# Altium project Control Panel v2.PrjPcb
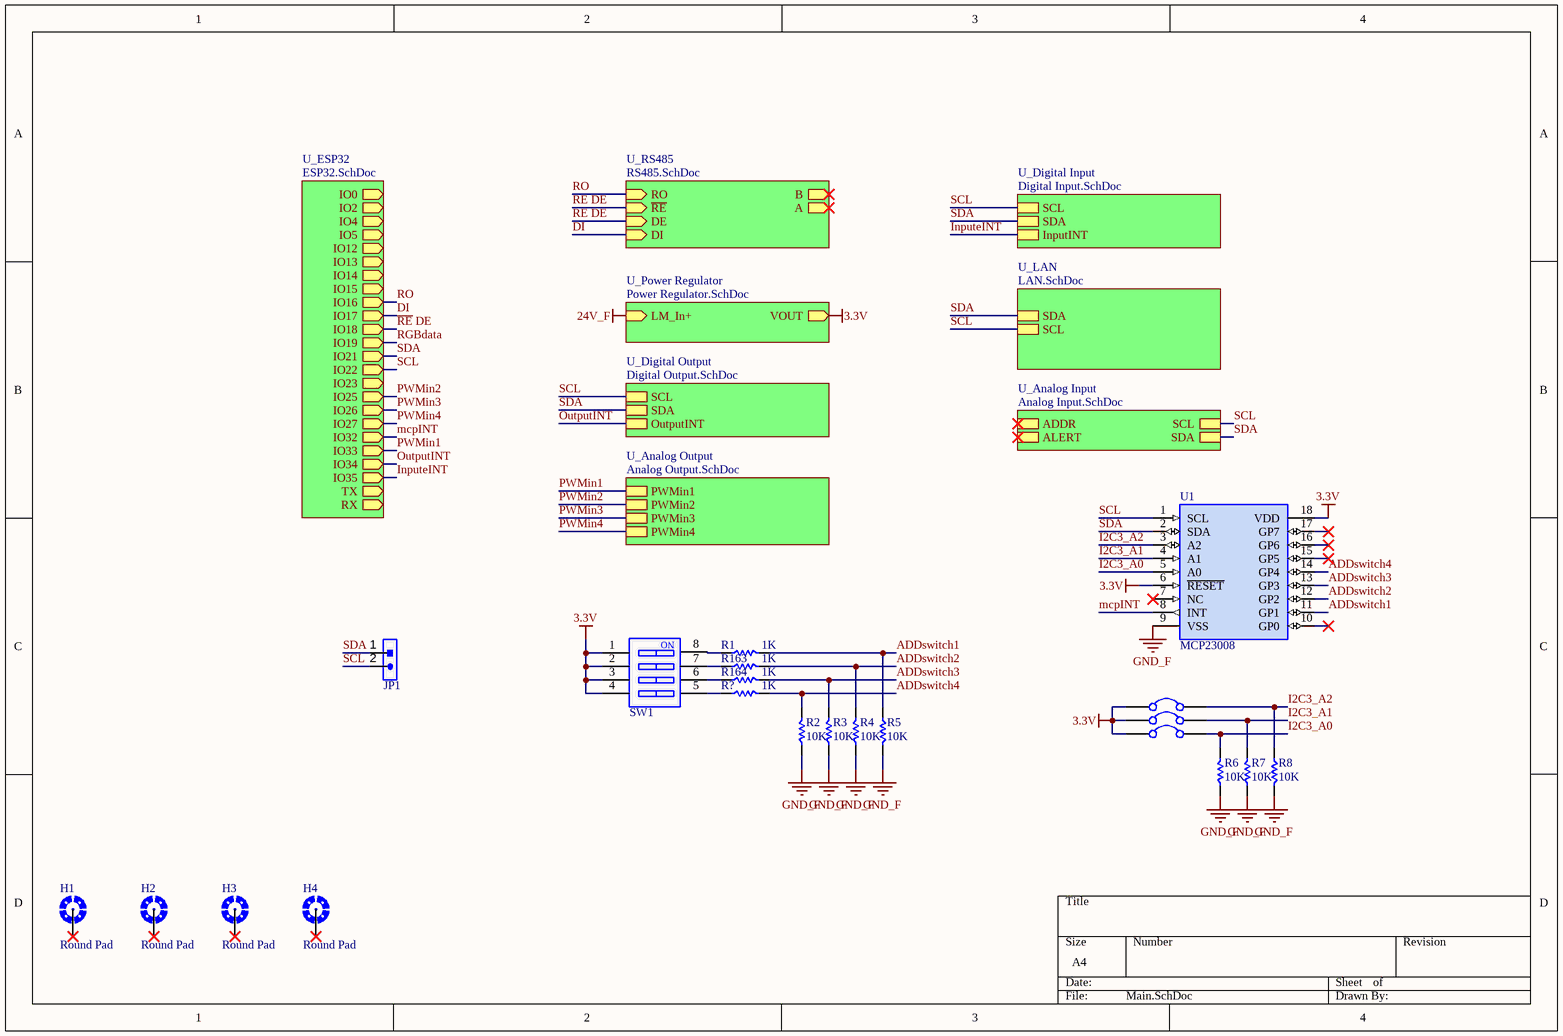
[diagram p0: Main.SchDoc]
8 sheets, 276 parts. Net scope: hierarchical (ports join the sheet entries above them; power ports are global).
Board file: Control Panel PCB v2.PcbDoc
Sheets:
  Main.SchDoc
    U_ESP32 = ESP32.SchDoc
    U_RS485 = RS485.SchDoc
    U_Power Regulator = Power Regulator.SchDoc
    U_Digital Output = Digital Output.SchDoc
    U_LAN = LAN.SchDoc
    U_Analog Input = Analog Input.SchDoc
    U_Analog Output = Analog Output.SchDoc

## Sheet Main.SchDoc
size A4; SheetNumber: 1; SheetTotal: 11

### Parts
(Parts that share a designator on the sheet are numbered #1, #2 ... from top to bottom, then left to right.)
H1  Round Pad  [P2.8CH]  (no BOM)
H2  Round Pad  [P2.8CH]  (no BOM)
H3  Round Pad  [P2.8CH]  (no BOM)
H4  Round Pad  [P2.8CH]  (no BOM)
JP1#1  HDR-1X2  [HDR-1X2_M]  (value not drawn)
R1  1K  [R 0805]
R2  10K  [R 0805]
R3  10K  [R 0805]
R4  10K  [R 0805]
R5  10K  [R 0805]
R6  10K  [R 0805]
R7  10K  [R 0805]
R8  10K  [R 0805]
R163  1K  [R 0805]
R164  1K  [R 0805]
R?  1K  [R 0805]
SB1  Solder Bridge  [Solder Bridge Open]  (value not drawn)
SB2  Solder Bridge  [Solder Bridge Open]  (value not drawn)
SB3  Solder Bridge  [Solder Bridge Open]  (value not drawn)
SW1  CSW-4P  [CSW DIP-4P_G]  (value not drawn)
U1  MCP23008  [SOP18W_M]

### Sub-sheets
U_Analog Input = Analog Input.SchDoc: ADDR, ALERT, SCL, SDA
U_Analog Output = Analog Output.SchDoc: PWMin1, PWMin2, PWMin3, PWMin4
U_Digital Input = Digital Input.SchDoc (file not in this document): SCL, SDA, InputINT
U_Digital Output = Digital Output.SchDoc: SCL, SDA, OutputINT
U_ESP32 = ESP32.SchDoc: IO2 (out), IO4 (out), IO5 (out), IO12 (out), IO13 (out), IO14 (out), IO15 (out), IO16 (out), IO17 (out), IO18 (out), IO19 (out), IO21 (out), IO22 (out), IO23 (out), IO25 (out), IO26 (out), IO27 (out), IO32 (out), IO33 (out), IO34 (out), IO35 (out), IO0 (out), TX (out), RX (out)
U_LAN = LAN.SchDoc: SDA, SCL
U_Power Regulator = Power Regulator.SchDoc: LM_In+ (in), VOUT (out)
U_RS485 = RS485.SchDoc: RO (in), ~{RE} (in), DE (in), DI (in), B (out), A (out)

### Nets
3.3V: SB1.1 SB2.1 SB3.1 SW1.1 SW1.2 SW1.3 SW1.4 U1.6(~{RESET}) U1.18(VDD) ; sheet U_Power Regulator/VOUT  [project net LM_Out+]
GND_F: R2.1 R3.1 R4.1 R5.2 R6.1 R7.1 R8.2 U1.9(VSS)
SHIELD: H1.P(Pad) H2.P(Pad) H3.P(Pad) H4.P(Pad)
ADDswitch1: R1.2 R5.1 U1.11(GP1)
ADDswitch2: R4.2 R163.2 U1.12(GP2)
ADDswitch3: R3.2 R164.2 U1.13(GP3)
ADDswitch4: R2.2 R?.2 U1.14(GP4)
DI: sheet U_ESP32/IO17, sheet U_RS485/DI  [project net 485_DI]
I2C3_A0: R6.2 SB3.2 U1.5(A0)
I2C3_A1: R7.2 SB2.2 U1.4(A1)
I2C3_A2: R8.1 SB1.2 U1.3(A2)
InputeINT: sheet U_ESP32/IO35, sheet U_Digital Input/InputINT
mcpINT: U1.8(INT) ; sheet U_ESP32/IO32
OutputINT: sheet U_ESP32/IO34, sheet U_Digital Output/OutputINT
PWMin1: sheet U_ESP32/IO33, sheet U_Analog Output/PWMin1
PWMin2: sheet U_ESP32/IO25, sheet U_Analog Output/PWMin2
PWMin3: sheet U_ESP32/IO26, sheet U_Analog Output/PWMin3
PWMin4: sheet U_ESP32/IO27, sheet U_Analog Output/PWMin4
~{RE} DE: sheet U_ESP32/IO18, sheet U_RS485/~{RE}, sheet U_RS485/DE  [project net 485_DE]
RO: sheet U_ESP32/IO16, sheet U_RS485/RO  [project net 485_RO]
SCL: JP1#1.2 U1.1(SCL) ; sheet U_ESP32/IO22, sheet U_Digital Output/SCL, sheet U_Digital Input/SCL, sheet U_LAN/SCL, sheet U_Analog Input/SCL
SDA: JP1#1.1 U1.2(SDA) ; sheet U_ESP32/IO21, sheet U_Digital Output/SDA, sheet U_Digital Input/SDA, sheet U_LAN/SDA, sheet U_Analog Input/SDA
NetR1_1: R1.1 SW1.8
NetR163_1: R163.1 SW1.7
NetR164_1: R164.1 SW1.6
NetR?_1: R?.1 SW1.5

Not connected (* = marked no-connect by the designer): U1 7(NC)* 10(GP0)* 15(GP5)* 16(GP6)* 17(GP7)*

### Notes on the sheet
- (in symbol CSW-4P) NO

### Library data of the parts
H1-H4 = MOUNT-PAD-ROUND-HOLES: MOUNTING PAD, round with holes around
JP1#1 = Header 2: 2P Connector; BOM名称: 2P接插件; 版权归属: 源创客; 学习资源: www.ooocke.com
R1-R8 R163 R164 R? = R: Chip resistor; 版权归属: 源创客; BOM名称: Chip resistor; 学习资源: www.ooocke.com
SW1 = CSW-4P: 4-way code switch; BOM名称: 4路编码开关; 版权归属: 源创客; 学习资源: www.ooocke.com
U1 = MCP23008: 8 Bit I/O Expander

## Sheet ESP32.SchDoc
size A4; SheetNumber: 6; SheetTotal: 11
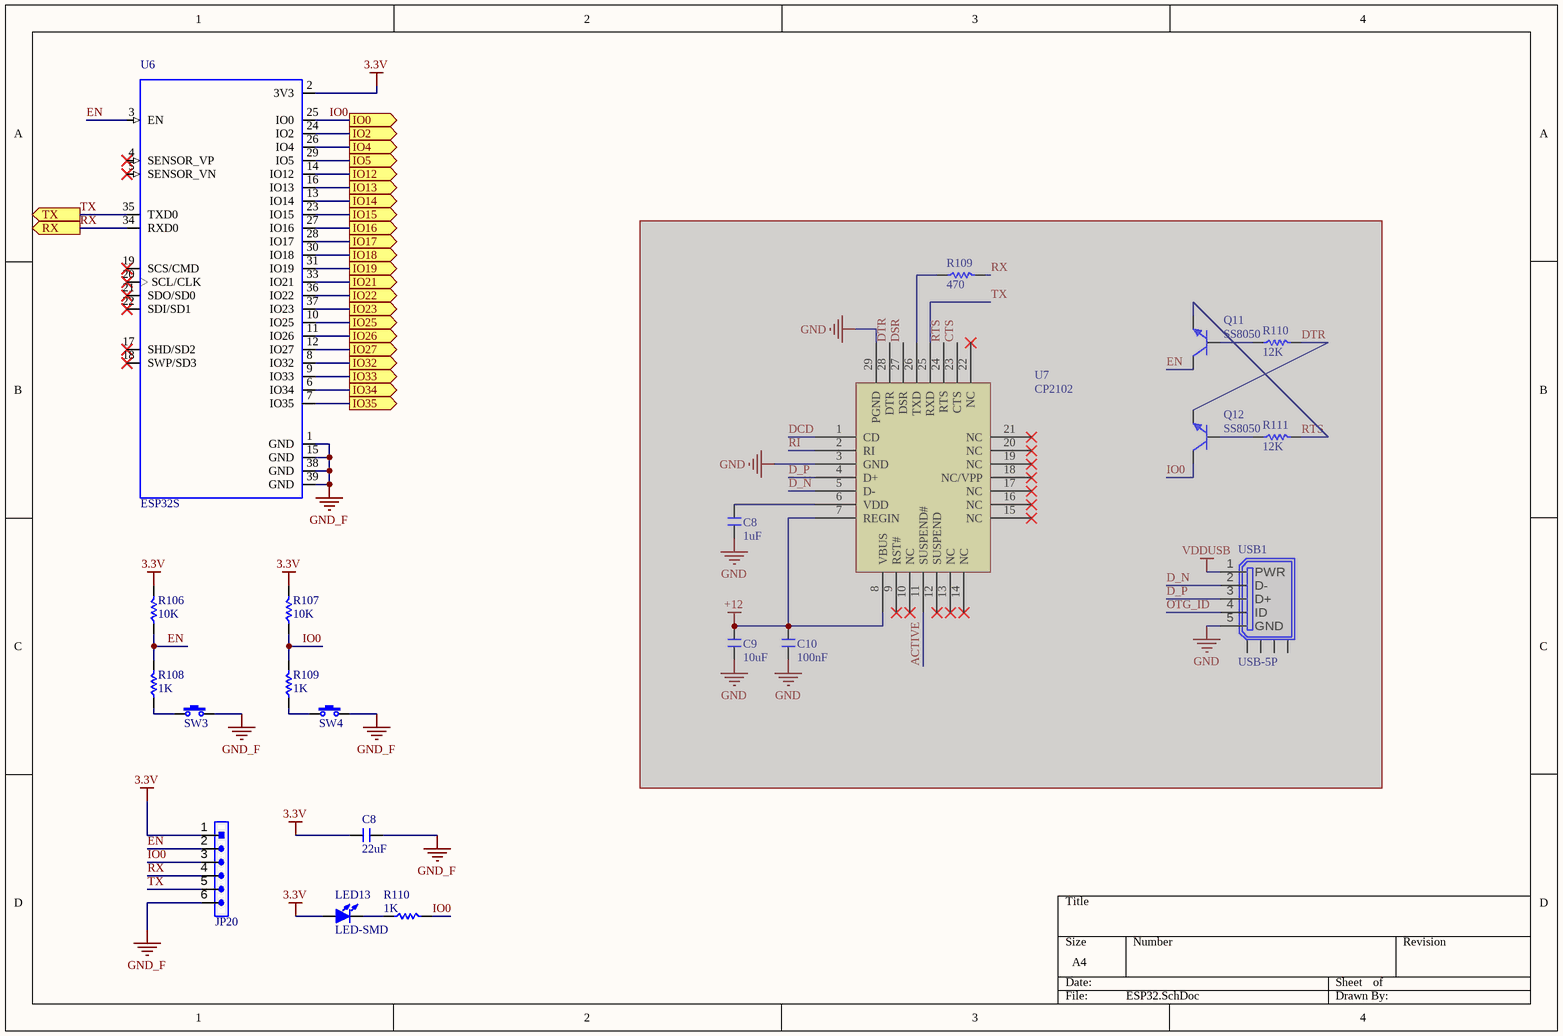
[diagram p1: ESP32.SchDoc]

### Parts
(Parts that share a designator on the sheet are numbered #1, #2 ... from top to bottom, then left to right.)
C8#1  1uF  [C 0805]  (masked out: inside a compile mask, not in the netlist)
C8#2  22uF  [C 0805]
C9#1  10uF  [C 0805]  (masked out: inside a compile mask, not in the netlist)
C10#1  100nF  [C 0805]  (masked out: inside a compile mask, not in the netlist)
JP20#1  HDR-1X6  [HDR-1X6]  (value not drawn)
LED13  LED-SMD  [LED 0805B]
Q11  SS8050  [SOT23-3N]  (masked out: inside a compile mask, not in the netlist)
Q12  SS8050  [SOT23-3N]  (masked out: inside a compile mask, not in the netlist)
R106  10K  [R 0805]
R107  10K  [R 0805]
R108  1K  [R 0805]
R109#1  470  [R 0805]  (masked out: inside a compile mask, not in the netlist)
R109#2  1K  [R 0805]
R110#1  12K  [R 0805]  (masked out: inside a compile mask, not in the netlist)
R110#2  1K  [R 0805]
R111#1  12K  [R 0805]  (masked out: inside a compile mask, not in the netlist)
SW3  3x6x5  [TSW SMD-3*6*2.5]  (value not drawn)
SW4  3x6x5  [TSW SMD-3*6*2.5]  (value not drawn)
U6  ESP32S  [ESP32S]
U7#1  CP2102  [QFN28]  (masked out: inside a compile mask, not in the netlist)
USB1  USB-5P  [USB-micro_B]  (masked out: inside a compile mask, not in the netlist)

### Ports
IO0 (out), IO2 (out), IO4 (out), IO5 (out), IO12 (out), IO13 (out), IO14 (out), IO15 (out), IO16 (out), IO17 (out), IO18 (out), IO19 (out), IO21 (out), IO22 (out), IO23 (out), IO25 (out), IO26 (out), IO27 (out), IO32 (out), IO33 (out), IO34 (out), IO35 (out), RX (out), TX (out)

### Nets
3.3V: C8#2.1 JP20#1.1 LED13.1(A) R106.2 R107.2 U6.2(3V3)  [project net LM_Out+]
GND_F: C8#2.2 JP20#1.6 SW3.2 SW4.2 U6.1(GND) U6.15(GND) U6.38(GND) U6.39(GND)
485_DE: U6.30(IO18) ; port IO18
485_DI: U6.28(IO17) ; port IO17
485_RO: U6.27(IO16) ; port IO16
EN: JP20#1.2 R106.1 R108.2 U6.3(EN)
InputeINT: U6.7(IO35) ; port IO35
IO0: JP20#1.3 R107.1 R109#2.2 R110#2.2 U6.25(IO0) ; port IO0
mcpINT: U6.8(IO32) ; port IO32
OutputINT: U6.6(IO34) ; port IO34
PWMin1: U6.9(IO33) ; port IO33
PWMin2: U6.10(IO25) ; port IO25
PWMin3: U6.11(IO26) ; port IO26
PWMin4: U6.12(IO27) ; port IO27
RGBdata: U6.31(IO19) ; port IO19
RX: JP20#1.4 U6.34(RXD0) ; port RX
SCL: U6.36(IO22) ; port IO22
SDA: U6.33(IO21) ; port IO21
TX: JP20#1.5 U6.35(TXD0) ; port TX
NetLED13_2: LED13.2(K) R110#2.1
NetR108_1: R108.1 SW3.1
NetR109#2_1: R109#2.1 SW4.1
NetU6_13: U6.13(IO14) ; port IO14
NetU6_14: U6.14(IO12) ; port IO12
NetU6_16: U6.16(IO13) ; port IO13
NetU6_23: U6.23(IO15) ; port IO15
NetU6_24: U6.24(IO2) ; port IO2
NetU6_26: U6.26(IO4) ; port IO4
NetU6_29: U6.29(IO5) ; port IO5
NetU6_37: U6.37(IO23) ; port IO23

Not connected (* = marked no-connect by the designer): U6 4(SENSOR_VP)* 5(SENSOR_VN)* 17(SHD/SD2)* 18(SWP/SD3)* 19(SCS/CMD)* 20(SCL/CLK)* 21(SDO/SD0)* 22(SDI/SD1)*

### Library data of the parts
C8#1 C8#2 C9#1 C10#1 = C: Non-polar patch capacitor; BOM名称: 无极性贴片电容; 版权归属: 源创客; 学习资源: www.ooocke.com
JP20#1 = Header 6: 6P Connector; BOM名称: 6P接插件; 版权归属: 源创客; 学习资源: www.ooocke.com
LED13 = LED-SMD: Patch LED; BOM名称: 贴片LED; 版权归属: 源创客; 学习资源: www.ooocke.com
Q11 Q12 = 8050-SMD: High frequency amplification-NPN; BOM名称: 高频放大-NPN型; 版权归属: 源创客; 属性: 40V 1.5A 1W 100MHZ; 学习资源: www.ooocke.com
R106-R108 R109#1 R109#2 R110#1 R110#2 R111#1 = R: Chip resistor; 版权归属: 源创客; BOM名称: Chip resistor; 学习资源: www.ooocke.com
SW3 SW4 = TSW 3x6: 3x6 tact switch; BOM名称: 3x6轻触开关; 版权归属: 源创客; 学习资源: www.ooocke.com
U6 = ESP32S: MP: ESP32-WROOM-32D; MF: Espressif Systems; Package: Module Espressif Systems; Price: None; Availability: Unavailable; SnapEDA_Link: https://www.snapeda.com/parts/ESP32-WROOM-32D/Espressif%20Systems/view-part/?ref=snap; Value: *
U7#1 = CP2102: USB to USRT converter
USB1 = USB-5P: Micro & Mini USB female; BOM名称: 微型USB母座; 版权归属: 源创客; 学习资源: www.ooocke.com

## Sheet RS485.SchDoc
size A4; SheetNumber: 5; SheetTotal: 11
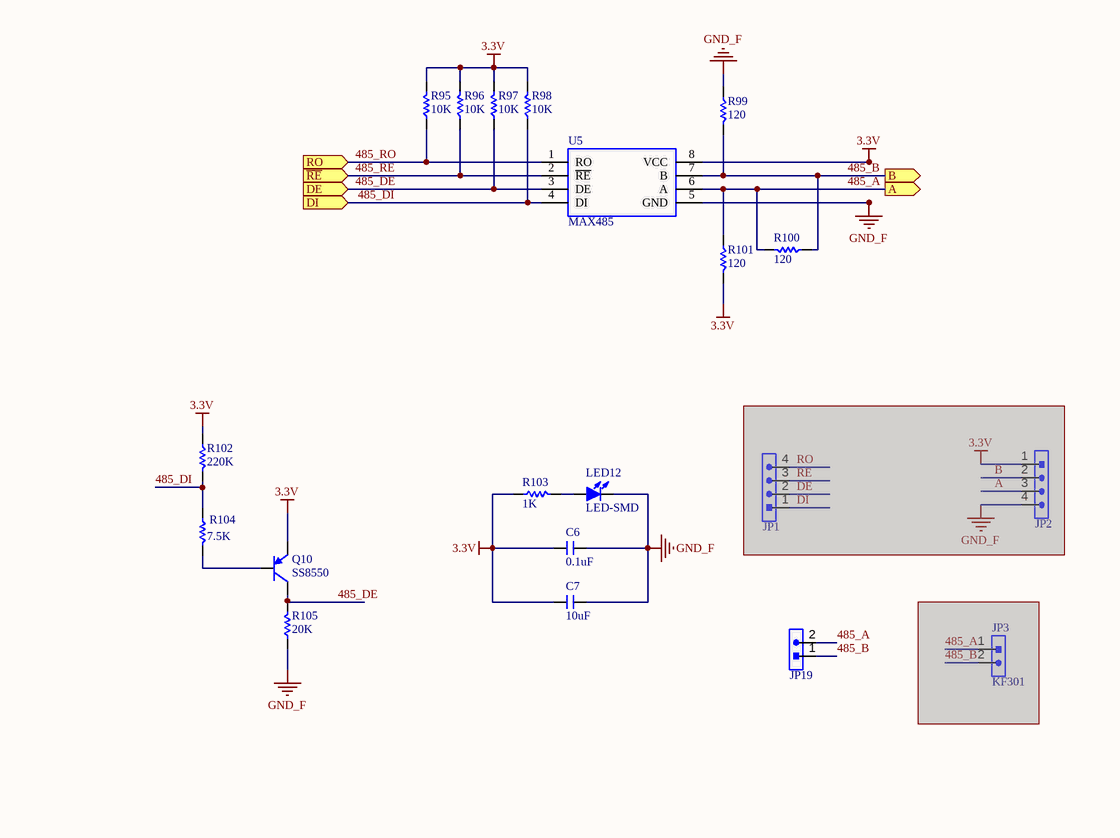
[diagram p2: RS485.SchDoc]

### Parts
(Parts that share a designator on the sheet are numbered #1, #2 ... from top to bottom, then left to right.)
C6  0.1uF  [C 0805]
C7  10uF  [C 1206]
JP1#2  HDR-1X4  [HDR-1X4]  (value not drawn)  (masked out: inside a compile mask, not in the netlist)
JP2#1  HDR-1X4  [HDR-1X4]  (value not drawn)  (masked out: inside a compile mask, not in the netlist)
JP3  KF301  [KF301-2P]  (masked out: inside a compile mask, not in the netlist)
JP19#1  HDR-1X2  [KF2EDGK-2P_H_5.08]  (value not drawn)
LED12  LED-SMD  [LED 0805R]
Q10  SS8550  [SOT23-3N]
R95  10K  [R 0805]
R96  10K  [R 0805]
R97  10K  [R 0805]
R98  10K  [R 0805]
R99  120  [R 0805]
R100  120  [R 0805]
R101  120  [R 0805]
R102  220K  [R 0805]
R103  1K  [R 0805]
R104  7.5K  [R 0805]
R105  20K  [R 0805]
U5  MAX485  [SOP8_N]

### Ports
A (out), B (out), DE (in), DI (in), RO (in), ~{RE} (in)

### Nets
3.3V: C6.1 C7.1 Q10.2(E) R95.2 R96.2 R97.2 R98.2 R101.2 R102.1 R103.1 U5.8(VCC)  [project net LM_Out+]
GND_F: C6.2 C7.2 LED12.2(K) R99.1 R105.1 U5.5(GND)
485_A: JP19#1.2 R100.2 R101.1 U5.6(A) ; port A
485_B: JP19#1.1 R99.2 R100.1 U5.7(B) ; port B
485_DE: Q10.3(C) R96.1 R97.1 R105.2 U5.2(~{RE}) U5.3(DE) ; port ~{RE}, port DE  [also labelled 485_~{RE}]
485_DI: R98.1 R102.2 R104.1 U5.4(DI) ; port DI
485_RO: R95.1 U5.1(RO) ; port RO
NetLED12_1: LED12.1(A) R103.2
NetQ10_1: Q10.1(B) R104.2

### Library data of the parts
C6 C7 = C: as C8#1 on sheet ESP32; 学习资源: www.ooocke.com
JP1#2 JP2#1 = Header 4: 4P Connector; BOM名称: 4P接插件; 版权归属: 源创客; 学习资源: www.ooocke.com
JP3 JP19#1 = Header 2: 2P Connector; BOM名称: 2P接插件; 版权归属: 源创客; 学习资源: www.ooocke.com
LED12 = LED-SMD: Patch LED; BOM名称: 贴片LED; 版权归属: 源创客; 学习资源: www.ooocke.com
Q10 = 8550-SMD: High Frequency Amplifier-PNP; BOM名称: 高频放大-PNP型; 版权归属: 源创客; 属性: 40V 1.5A 1W 100MHZ; 学习资源: www.ooocke.com
R95-R105 = R: Chip resistor; 版权归属: 源创客; BOM名称: Chip resistor; 学习资源: www.ooocke.com
U5 = MAX485: RS485/RS422 Transceivers; BOM名称: MAX232; 版权归属: 源创客; 学习资源: www.ooocke.com

## Sheet Power Regulator.SchDoc
size A4; SheetNumber: 2; SheetTotal: 11
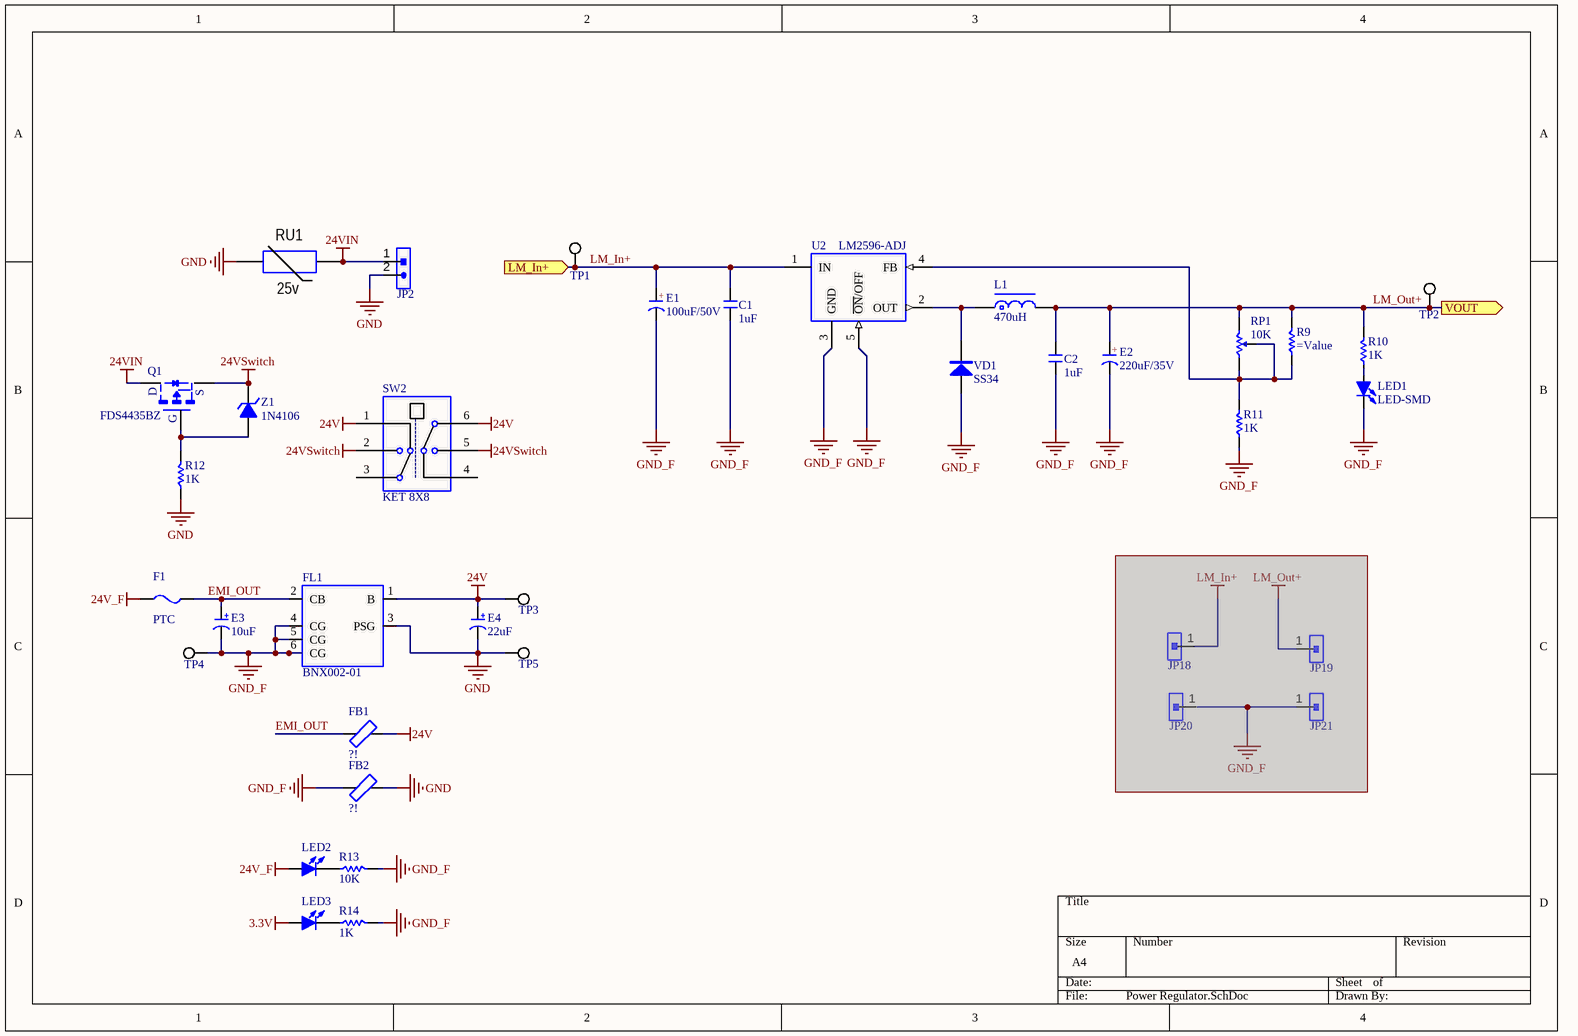
[diagram p3: Power Regulator.SchDoc]

### Parts
(Parts that share a designator on the sheet are numbered #1, #2 ... from top to bottom, then left to right.)
C1  1uF  [C 0805]
C2  1uF  [C 0805]
E1  100uF/50V  [CM E(8*10.2)]
E2  220uF/35V  [CM E(8*10.2)]
E3  10uF  [CM D(6.3*7.7)]
E4  22uF  [CM D(6.3*7.7)]
F1  PTC  [PTC]
FB1  ?!  [F 1206]
FB2  ?!  [F 1206]
FL1  BNX002-01  [FIL_BNX002-01]
JP2#2  HDR-1X2  [KF2EDGK-2P_H_7.62]  (value not drawn)
JP18#1  HDR-1X1  [HDR-1X1]  (value not drawn)  (masked out: inside a compile mask, not in the netlist)
JP19#2  HDR-1X1  [HDR-1X1]  (value not drawn)  (masked out: inside a compile mask, not in the netlist)
JP20#2  HDR-1X1  [HDR-1X1]  (value not drawn)  (masked out: inside a compile mask, not in the netlist)
JP21#1  HDR-1X1  [HDR-1X1]  (value not drawn)  (masked out: inside a compile mask, not in the netlist)
L1  470uH  [CDRH127]
LED1  LED-SMD  [LED 0805R]
LED2  LED-SMD  [LED 0805R]  (value not drawn)
LED3  LED-SMD  [LED 0805R]  (value not drawn)
Q1  FDS4435BZ  [SOP8-E3]
R9  (no value)  [R 0805]
R10  1K  [R 0805]
R11  1K  [R 0805]
R12  1K  [R 0805]
R13  10K  [R 0805]
R14  1K  [R 0805]
RP1  10K  [3296W]
RU1  25v  [SMA]
SW2  KET 8X8  [KFT DIP-8X8]
TP1  Test Point Pad  [TP15]  (value not drawn)
TP2  Test Point Pad  [TP15]  (value not drawn)
TP3  Test Point Pad  [TP15]  (value not drawn)
TP4  Test Point Pad  [TP15]  (value not drawn)
TP5  Test Point Pad  [TP15]  (value not drawn)
U2  LM2596-ADJ  [TO263-5A]
VD1  SS34  [SMA]
Z1  1N4106  [DO-213AA]

### Ports
LM_In+ (in), VOUT (out)

### Nets
24V: E4.1(A) FB1.2 FL1.1(B) SW2.1 SW2.6 TP3.1
24VIN: JP2#2.1 Q1.5-8(D) RU1.2
24VSwitch: Q1.1-3(S) SW2.2 SW2.5 Z1.2(K)
GND: E4.2(K) FB2.2 FL1.3(PSG) JP2#2.2 R12.1 RU1.1 TP5.1
GND_F: C1.1 C2.1 E1.2(K) E2.2(K) E3.2(K) FB2.1 FL1.4(CG) FL1.5(CG) FL1.6(CG) LED1.2(K) R11.1 R13.2 R14.2 TP4.1 U2.3(GND) U2.5(~{ON}/OFF) VD1.1(A)
LM_In+: C1.2 E1.1(A) F1.1 LED2.1(A) TP1.1 U2.1(IN) ; port LM_In+  [also labelled 24V_F]
LM_Out+: C2.2 E2.1(A) L1.2 LED3.1(A) R9.2 R10.2 RP1.2 TP2.1 ; port VOUT  [also labelled 3.3V]
EMI_OUT: E3.1(A) F1.2 FB1.1 FL1.2(CB)
NetL1_1: L1.1 U2.2(OUT) VD1.2(K)
NetLED1_1: LED1.1(A) R10.1
NetLED2_2: LED2.2(K) R13.1
NetLED3_2: LED3.2(K) R14.1
NetQ1_4: Q1.4(G) R12.2 Z1.1(A)
NetR9_1: R9.1 R11.2 RP1.1 RP1.ADJ U2.4(FB)

Not connected (* = marked no-connect by the designer): SW2 3 4

### Notes on the sheet
- (in symbol C-CM) +
- (in symbol KET 8X8) ---------------

### Library data of the parts
C1 C2 = C: as C8#1 on sheet ESP32; 学习资源: www.ooocke.com
E1-E4 = C-CM: Chip electrolytic capacitor; BOM名称: 贴片电解电容; 版权归属: 源创客; 学习资源: www.ooocke.com
FB1 FB2 = FB: Ferrite Bead; BOM名称: 贴片电阻; 版权归属: 源创客; 学习资源: www.ooocke.com
FL1 = BNX002-01: LC EMI Filter 5th Order Low Pass 2 Channel 10A Block, 4 Lead; MF: Murata; Package: Block-4 Murata; Price: None; SnapEDA_Link: https://www.snapeda.com/parts/BNX002-01/Murata%20Electronics%20North%20America/view-part/12269/?ref=snap; Availability: Unavailable; Value: *; MP: BNX002-01
JP2#2 = Header 2: 2P Connector; BOM名称: 2P接插件; 版权归属: 源创客; 学习资源: www.ooocke.com
JP18#1 JP19#2 JP20#2 JP21#1 = Header 1: 1P Connector; BOM名称: 1P接插件; 版权归属: 源创客; 学习资源: www.ooocke.com
L1 = L-CDRH: Power shielded inductor; BOM名称: 功率屏蔽电感; 版权归属: 源创客; 学习资源: www.ooocke.com
LED1-LED3 = LED-SMD: Patch LED; BOM名称: 贴片LED; 版权归属: 源创客; 学习资源: www.ooocke.com
R9-R14 = R: Chip resistor; 版权归属: 源创客; BOM名称: Chip resistor; 学习资源: www.ooocke.com
RP1 = RP-THD: Plug-in potentiometer; BOM名称: 插件电位器; 版权归属: 源创客; 学习资源: www.ooocke.com
RU1 = V: Versiror; Manufacturer: *; Model: *; HelpURL: *; ComponentKind: *; Value: *
SW2 = KET 8X8: 8*8 switch; BOM名称: 8*8开关; 版权归属: 源创客; 学习资源: www.ooocke.com
TP1-TP5 = Test Point Pad: Company: SJ Libraries; Designer: Eng. Saeid Jorablo; Rule: UNIONINDEX=0|RULEKIND=ComponentClearance|NETSCOPE=AnyNet|LAYERKIND=SameLayer|NAME=Schematic Component Clearance Constraint|GAP=0mil|COLLISIONCHECKMODE=3|VERTICALGAP=0mil|SHOWDISTANCES=FALSE|UNIT=Imperial; Mounting Technology: Surface Mount\Through-Hole; ComponentLink1Description: Datasheet; Pin Count: 0; Update Date: 6/3/2012; Category: MISC; HelpURL: http://s3.picofile.com/file/7443264187/Coming_Soon_logo.gif
U2 = LM2596: DC step-down chip; BOM名称: DC稳压芯片; 版权归属: 源创客; 学习资源: www.ooocke.com
VD1 = SS34: Schottky diodes; BOM名称: 肖特基二极管; 版权归属: 源创客; 属性: 40V/3A; 学习资源: www.ooocke.com
Z1 = 1N4106: 12V/0.5W voltage regulator; BOM名称: 12V/0.5W稳压管; 版权归属: 源创客; 学习资源: www.ooocke.com

## Sheet Digital Output.SchDoc
size A4; SheetNumber: 4; SheetTotal: 11
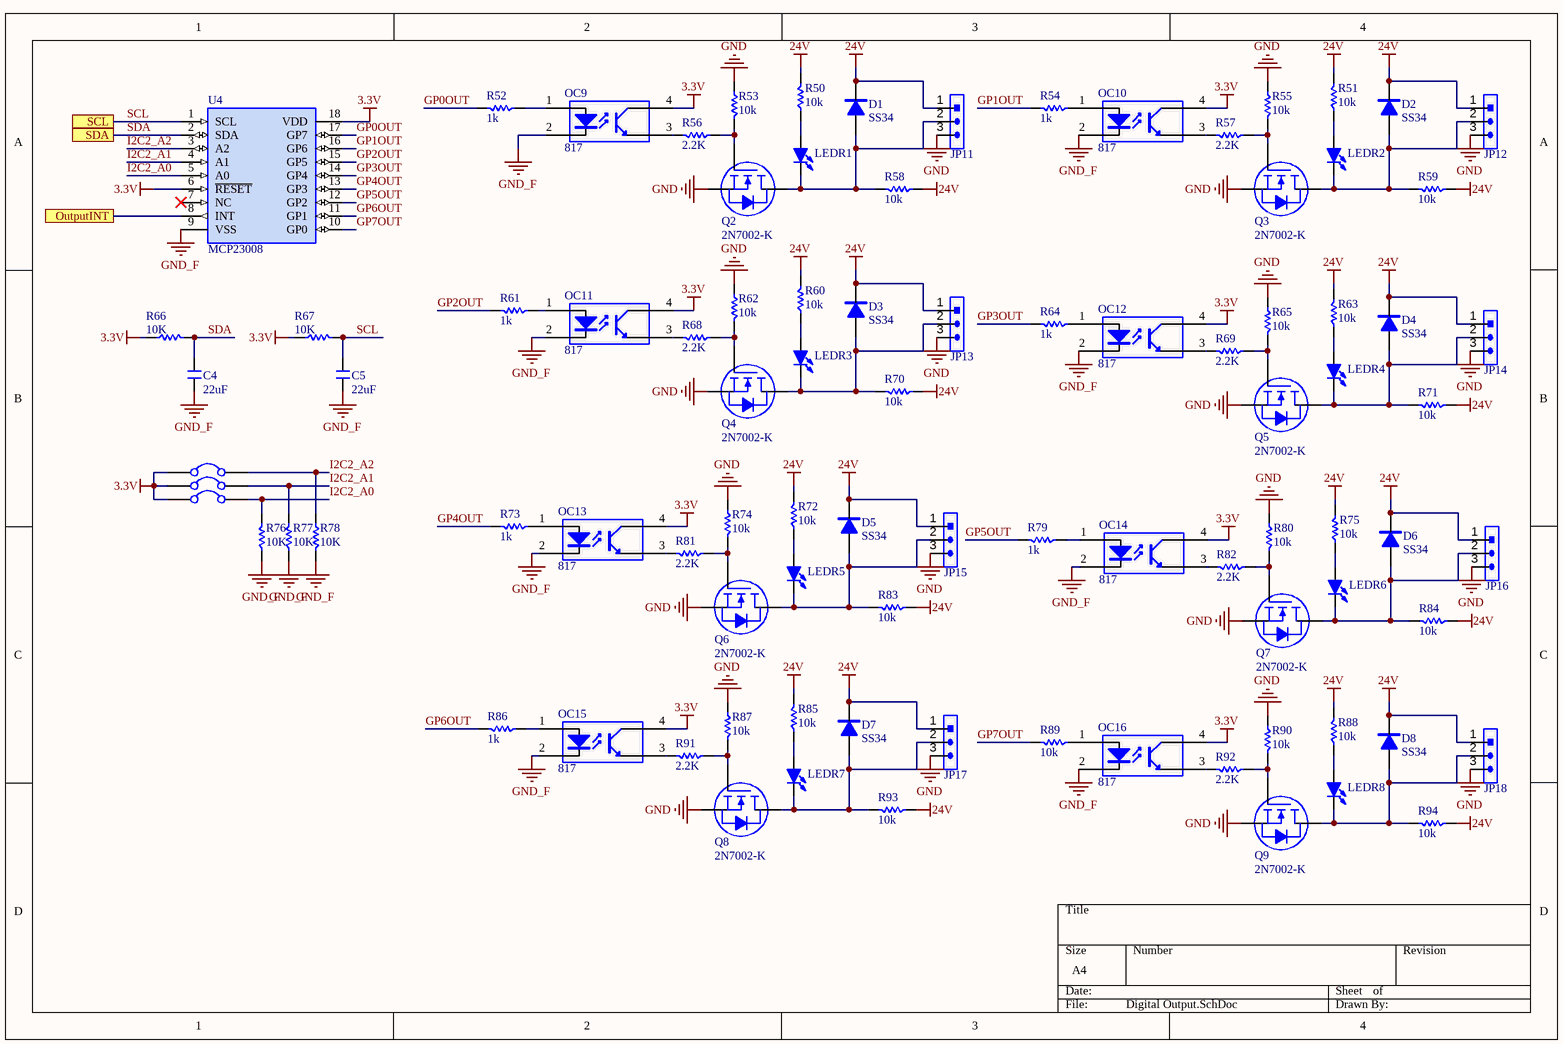
[diagram p4: Digital Output.SchDoc]

### Parts
(Parts that share a designator on the sheet are numbered #1, #2 ... from top to bottom, then left to right.)
C4  22uF  [C 0805]
C5  22uF  [C 0805]
D1  SS34  [SMA]
D2  SS34  [SMA]
D3  SS34  [SMA]
D4  SS34  [SMA]
D5  SS34  [SMA]
D6  SS34  [SMA]
D7  SS34  [SMA]
D8  SS34  [SMA]
JP11  HDR-1X3  [KF301-3P]  (value not drawn)
JP12  HDR-1X3  [KF301-3P]  (value not drawn)
JP13  HDR-1X3  [KF301-3P]  (value not drawn)
JP14  HDR-1X3  [KF301-3P]  (value not drawn)
JP15  HDR-1X3  [KF301-3P]  (value not drawn)
JP16  HDR-1X3  [KF301-3P]  (value not drawn)
JP17  HDR-1X3  [KF301-3P]  (value not drawn)
JP18#2  HDR-1X3  [KF301-3P]  (value not drawn)
LEDR1  LED-SMD  [LED 0805R]  (value not drawn)
LEDR2  LED-SMD  [LED 0805R]  (value not drawn)
LEDR3  LED-SMD  [LED 0805R]  (value not drawn)
LEDR4  LED-SMD  [LED 0805R]  (value not drawn)
LEDR5  LED-SMD  [LED 0805R]  (value not drawn)
LEDR6  LED-SMD  [LED 0805R]  (value not drawn)
LEDR7  LED-SMD  [LED 0805R]  (value not drawn)
LEDR8  LED-SMD  [LED 0805R]  (value not drawn)
OC9  817  [PC817-SMD]
OC10  817  [PC817-SMD]
OC11  817  [PC817-SMD]
OC12  817  [PC817-SMD]
OC13  817  [PC817-SMD]
OC14  817  [PC817-SMD]
OC15  817  [PC817-SMD]
OC16  817  [PC817-SMD]
Q2  2N7002-K  [SOT23-3L]
Q3  2N7002-K  [SOT23-3L]
Q4  2N7002-K  [SOT23-3L]
Q5  2N7002-K  [SOT23-3L]
Q6  2N7002-K  [SOT23-3L]
Q7  2N7002-K  [SOT23-3L]
Q8  2N7002-K  [SOT23-3L]
Q9  2N7002-K  [SOT23-3L]
R50  10k  [R 0805]
R51  10k  [R 0805]
R52  1k  [R 0805]
R53  10k  [R 0805]
R54  1k  [R 0805]
R55  10k  [R 0805]
R56  2.2K  [R 0805]
R57  2.2K  [R 0805]
R58  10k  [R 0805]
R59  10k  [R 0805]
R60  10k  [R 0805]
R61  1k  [R 0805]
R62  10k  [R 0805]
R63  10k  [R 0805]
R64  1k  [R 0805]
R65  10k  [R 0805]
R66  10K  [R 0805]
R67  10K  [R 0805]
R68  2.2K  [R 0805]
R69  2.2K  [R 0805]
R70  10k  [R 0805]
R71  10k  [R 0805]
R72  10k  [R 0805]
R73  1k  [R 0805]
R74  10k  [R 0805]
R75  10k  [R 0805]
R76  10K  [R 0805]
R77  10K  [R 0805]
R78  10K  [R 0805]
R79  1k  [R 0805]
R80  10k  [R 0805]
R81  2.2K  [R 0805]
R82  2.2K  [R 0805]
R83  10k  [R 0805]
R84  10k  [R 0805]
R85  10k  [R 0805]
R86  1k  [R 0805]
R87  10k  [R 0805]
R88  10k  [R 0805]
R89  10k  [R 0805]
R90  10k  [R 0805]
R91  2.2K  [R 0805]
R92  2.2K  [R 0805]
R93  10k  [R 0805]
R94  10k  [R 0805]
SB7  Solder Bridge  [Solder Bridge Open]  (value not drawn)
SB8  Solder Bridge  [Solder Bridge Open]  (value not drawn)
SB9  Solder Bridge  [Solder Bridge Open]  (value not drawn)
U4  MCP23008  [SOP18W_M]

### Ports
OutputINT, SCL, SDA

### Nets
3.3V: OC9.4(C) OC10.4(C) OC11.4(C) OC12.4(C) OC13.4(C) OC14.4(C) OC15.4(C) OC16.4(C) R66.1 R67.1 SB7.1 SB8.1 SB9.1 U4.6(~{RESET}) U4.18(VDD)  [project net LM_Out+]
24V: D1.2(K) D2.2(K) D3.2(K) D4.2(K) D5.2(K) D6.2(K) D7.2(K) D8.2(K) JP11.1 JP12.1 JP13.1 JP14.1 JP15.1 JP16.1 JP17.1 JP18#2.1 R50.2 R51.2 R58.1 R59.1 R60.2 R63.2 R70.1 R71.1 R72.2 R75.2 R83.1 R84.1 R85.2 R88.2 R93.1 R94.1
GND: JP11.3 JP12.3 JP13.3 JP14.3 JP15.3 JP16.3 JP17.3 JP18#2.3 Q2.2(S) Q3.2(S) Q4.2(S) Q5.2(S) Q6.2(S) Q7.2(S) Q8.2(S) Q9.2(S) R53.1 R55.1 R62.1 R65.1 R74.1 R80.1 R87.1 R90.1
GND_F: C4.1 C5.1 OC9.2(K) OC10.2(K) OC11.2(K) OC12.2(K) OC13.2(K) OC14.2(K) OC15.2(K) OC16.2(K) R76.1 R77.1 R78.2 U4.9(VSS)
GP0OUT: R52.2 U4.17(GP7)
GP1OUT: R54.2 U4.16(GP6)
GP2OUT: R61.2 U4.15(GP5)
GP3OUT: R64.2 U4.14(GP4)
GP4OUT: R73.2 U4.13(GP3)
GP5OUT: R79.2 U4.12(GP2)
GP6OUT: R86.2 U4.11(GP1)
GP7OUT: R89.2 U4.10(GP0)
I2C2_A0: R76.2 SB9.2 U4.5(A0)
I2C2_A1: R77.2 SB8.2 U4.4(A1)
I2C2_A2: R78.1 SB7.2 U4.3(A2)
OutputINT: U4.8(INT) ; port OutputINT
SCL: C5.2 R67.2 U4.1(SCL) ; port SCL
SDA: C4.2 R66.2 U4.2(SDA) ; port SDA
NetD1_1: D1.1(A) JP11.2 LEDR1.2(K) Q2.3(D) R58.2
NetD2_1: D2.1(A) JP12.2 LEDR2.2(K) Q3.3(D) R59.2
NetD3_1: D3.1(A) JP13.2 LEDR3.2(K) Q4.3(D) R70.2
NetD4_1: D4.1(A) JP14.2 LEDR4.2(K) Q5.3(D) R71.2
NetD5_1: D5.1(A) JP15.2 LEDR5.2(K) Q6.3(D) R83.2
NetD6_1: D6.1(A) JP16.2 LEDR6.2(K) Q7.3(D) R84.2
NetD7_1: D7.1(A) JP17.2 LEDR7.2(K) Q8.3(D) R93.2
NetD8_1: D8.1(A) JP18#2.2 LEDR8.2(K) Q9.3(D) R94.2
NetLEDR1_1: LEDR1.1(A) R50.1
NetLEDR2_1: LEDR2.1(A) R51.1
NetLEDR3_1: LEDR3.1(A) R60.1
NetLEDR4_1: LEDR4.1(A) R63.1
NetLEDR5_1: LEDR5.1(A) R72.1
NetLEDR6_1: LEDR6.1(A) R75.1
NetLEDR7_1: LEDR7.1(A) R85.1
NetLEDR8_1: LEDR8.1(A) R88.1
NetOC9_1: OC9.1(A) R52.1
NetOC9_3: OC9.3(E) R56.2
NetOC10_1: OC10.1(A) R54.1
NetOC10_3: OC10.3(E) R57.2
NetOC11_1: OC11.1(A) R61.1
NetOC11_3: OC11.3(E) R68.2
NetOC12_1: OC12.1(A) R64.1
NetOC12_3: OC12.3(E) R69.2
NetOC13_1: OC13.1(A) R73.1
NetOC13_3: OC13.3(E) R81.2
NetOC14_1: OC14.1(A) R79.1
NetOC14_3: OC14.3(E) R82.2
NetOC15_1: OC15.1(A) R86.1
NetOC15_3: OC15.3(E) R91.2
NetOC16_1: OC16.1(A) R89.1
NetOC16_3: OC16.3(E) R92.2
NetQ2_1: Q2.1(G) R53.2 R56.1
NetQ3_1: Q3.1(G) R55.2 R57.1
NetQ4_1: Q4.1(G) R62.2 R68.1
NetQ5_1: Q5.1(G) R65.2 R69.1
NetQ6_1: Q6.1(G) R74.2 R81.1
NetQ7_1: Q7.1(G) R80.2 R82.1
NetQ8_1: Q8.1(G) R87.2 R91.1
NetQ9_1: Q9.1(G) R90.2 R92.1

Not connected (* = marked no-connect by the designer): U4 7(NC)*

### Library data of the parts
C4 C5 = C: as C8#1 on sheet ESP32; 学习资源: www.ooocke.com
D1-D8 = M7: Rectifier diode; BOM名称: 整流二极管; 版权归属: 源创客; 学习资源: www.ooocke.com
JP11-JP17 JP18#2 = Header 3: 3P Connector; BOM名称: 3P接插件; 版权归属: 源创客; 学习资源: www.ooocke.com
LEDR1-LEDR8 = LED-SMD: Patch LED; BOM名称: 贴片LED; 版权归属: 源创客; 学习资源: www.ooocke.com
OC9-OC16 = 817: AC Input Photocoupler; BOM名称: 线性光耦; 版权归属: 源创客; 学习资源: www.ooocke.com
Q2-Q9 = 2N7002-SMD: N-Channel Enhancement Mode Field Effect Transistor
R50-R94 = R: Chip resistor; 版权归属: 源创客; BOM名称: Chip resistor; 学习资源: www.ooocke.com
U4 = MCP23008: 8 Bit I/O Expander

## Sheet LAN.SchDoc
size A4; SheetNumber: 10; SheetTotal: 11
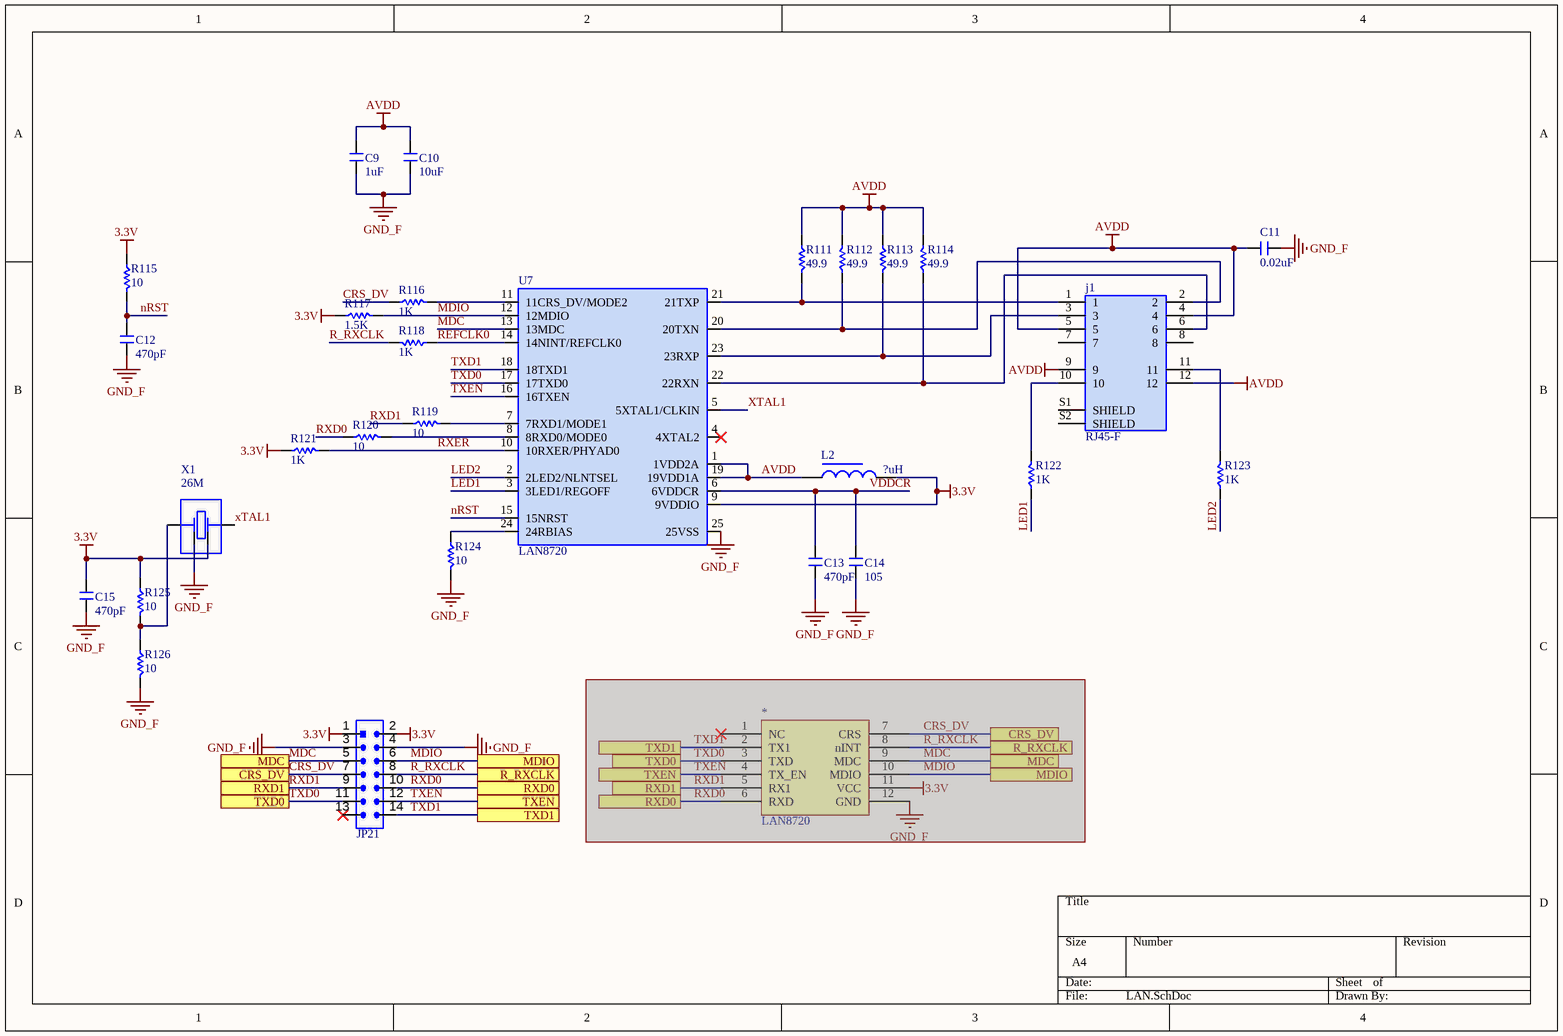
[diagram p5: LAN.SchDoc]

### Parts
(Parts that share a designator on the sheet are numbered #1, #2 ... from top to bottom, then left to right.)
*  LAN8720  [LAN8720_module]  (masked out: inside a compile mask, not in the netlist)
C9#2  1uF  [C 0603]
C10#2  10uF  [C 0603]
C11  0.02uF  [C 0603]
C12  470pF  [C 0603]
C13  470pF  [C 0603]
C14  105  [C 0603]
C15  470pF  [C 0603]
j1  RJ45-F  [rj45-f]
JP21#2  Header 2X7  [HDR-7X2]  (value not drawn)
L2  ?uH  [L 0603]
R111#2  49.9  [R 0603]
R112  49.9  [R 0603]
R113  49.9  [R 0603]
R114  49.9  [R 0603]
R115  10  [R 0603]
R116  1K  [R 0603]
R117  1.5K  [R 0603]
R118  1K  [R 0603]
R119  10  [R 0603]
R120  10  [R 0603]
R121  1K  [R 0603]
R122  1K  [R 0603]
R123  1K  [R 0603]
R124  10  [R 0603]
R125  10  [R 0603]
R126  10  [R 0603]
U7#2  LAN8720  [LAN8720]
X1  26M  [XTAL-5070-4]

### Ports
CRS_DV, MDC, MDIO, R_RXCLK, RXD0, RXD1, TXD0, TXD1, TXEN

### Nets
3.3V: C15.1 JP21#2.1 JP21#2.2 L2.2 R115.1 R117.1 R121.1 R125.1 U7#2.9(9VDDIO) X1.4  [project net LM_Out+]
AVDD: C9#2.1 C10#2.1 C11.1 j1.4 j1.5 j1.9 j1.12 L2.1 R111#2.1 R112.2 R113.1 R114.2 U7#2.1(1VDD2A) U7#2.19(19VDD1A)
GND_F: C9#2.2 C10#2.2 C11.2 C12.1 C13.1 C14.1 C15.2 JP21#2.3 JP21#2.4 R124.2 R126.2 U7#2.25(25VSS) X1.2
CRS_DV: JP21#2.7 R116.1 ; port CRS_DV
LED1: R122.1 U7#2.3(3LED1/REGOFF)
LED2: R123.1 U7#2.2(2LED2/NLNTSEL)
MDC: JP21#2.5 U7#2.13(13MDC) ; port MDC
MDIO: JP21#2.6 R117.2 U7#2.12(12MDIO) ; port MDIO
nRST: C12.2 R115.2 U7#2.15(15NRST)
R_RXCLK: JP21#2.8 R118.2 ; port R_RXCLK
REFCLK0: R118.1 U7#2.14(14NINT/REFCLK0)
RXD0: JP21#2.10 R120.1 ; port RXD0
RXD1: JP21#2.9 R119.1 ; port RXD1
RXER: R121.2 U7#2.10(10RXER/PHYAD0)
TXD0: JP21#2.11 U7#2.17(17TXD0) ; port TXD0
TXD1: JP21#2.14 U7#2.18(18TXD1) ; port TXD1
TXEN: JP21#2.12 U7#2.16(16TXEN) ; port TXEN
VDDCR: C13.2 C14.2 U7#2.6(6VDDCR)
XTAL1: U7#2.5(5XTAL1/CLKIN) X1.3
Netj1_1: j1.1 R111#2.2 U7#2.21(21TXP)
Netj1_2: j1.2 R112.1 U7#2.20(20TXN)
Netj1_3: j1.3 R113.2 U7#2.23(23RXP)
Netj1_6: j1.6 R114.1 U7#2.22(22RXN)
Netj1_10: j1.10 R122.2
Netj1_11: j1.11 R123.2
NetR116_2: R116.2 U7#2.11(11CRS_DV/MODE2)
NetR119_2: R119.2 U7#2.7(7RXD1/MODE1)
NetR120_2: R120.2 U7#2.8(8RXD0/MODE0)
NetR124_1: R124.1 U7#2.24(24RBIAS)
NetR125_2: R125.2 R126.1 X1.1

Not connected (* = marked no-connect by the designer): j1 7 8 S1(SHIELD) S2(SHIELD); JP21#2 13*; U7#2 4(4XTAL2)*

### Library data of the parts
C9#2 C10#2 C11-C15 = C: as C8#1 on sheet ESP32; 学习资源: www.ooocke.com
JP21#2 = Header 7X2: 7*2P Connector; BOM名称: 7*2P接插件; 版权归属: 源创客; 学习资源: www.ooocke.com
L2 = L: Low power chip inductor; BOM名称: 小功率贴片电感; 版权归属: 源创客; 学习资源: www.ooocke.com
R111#2 R112-R126 = R: Chip resistor; 版权归属: 源创客; BOM名称: Chip resistor; 学习资源: www.ooocke.com
X1 = XTAL-4: 4-Pin crystal; BOM名称: 4脚晶振; 版权归属: 源创客; 学习资源: www.ooocke.com

## Sheet Analog Input.SchDoc
size A4; SheetNumber: 8; SheetTotal: 11
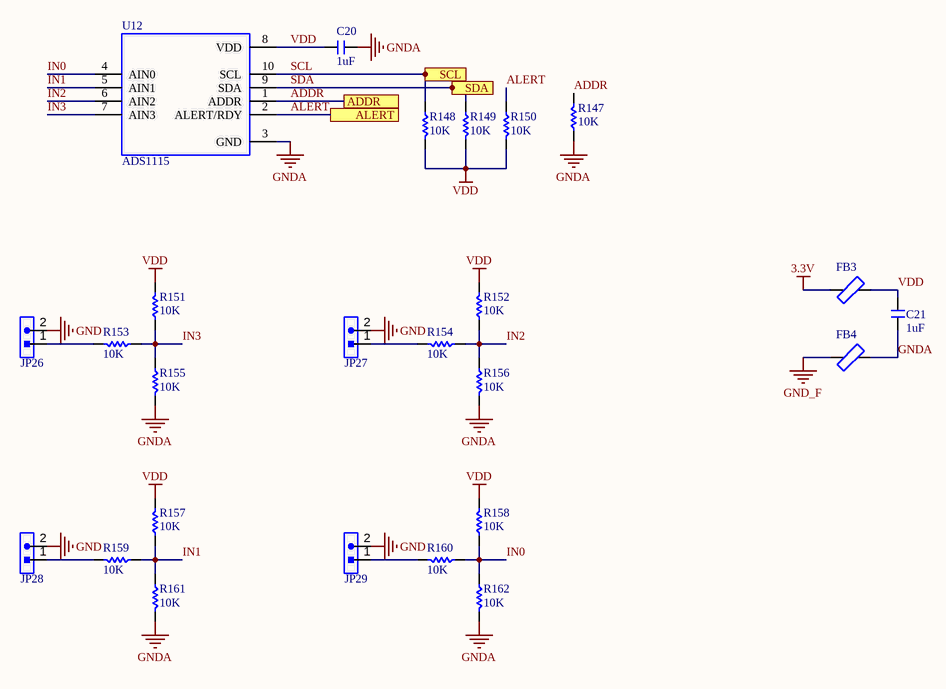
[diagram p6: Analog Input.SchDoc]

### Parts
C20  1uF  [C 0805]
C21  1uF  [C 0805]
FB3  (no value)  [F 0805]
FB4  (no value)  [F 0805]
JP26  HDR-1X2  [KF301-2P]  (value not drawn)
JP27  HDR-1X2  [KF301-2P]  (value not drawn)
JP28  HDR-1X2  [KF301-2P]  (value not drawn)
JP29  HDR-1X2  [KF301-2P]  (value not drawn)
R147  10K  [R 0805]
R148  10K  [R 0805]
R149  10K  [R 0805]
R150  10K  [R 0805]
R151  10K  [R 0805]
R152  10K  [R 0805]
R153  10K  [R 0805]
R154  10K  [R 0805]
R155  10K  [R 0805]
R156  10K  [R 0805]
R157  10K  [R 0805]
R158  10K  [R 0805]
R159  10K  [R 0805]
R160  10K  [R 0805]
R161  10K  [R 0805]
R162  10K  [R 0805]
U12  ADS1115  [VSSOP10-N]

### Ports
ADDR, ALERT, SCL, SDA

### Nets
3.3V: FB3.1  [project net LM_Out+]
GND: JP26.2 JP27.2 JP28.2 JP29.2
GND_F: FB4.1
GNDA: C20.1 C21.1 FB4.2 R147.1 R155.2 R156.2 R161.2 R162.2 U12.3(GND)
VDD: C20.2 C21.2 FB3.2 R148.2 R149.2 R150.2 R151.2 R152.2 R157.2 R158.2 U12.8(VDD)
ADDR: R147.2 U12.1(ADDR) ; port ADDR
ALERT: R150.1 U12.2(ALERT/RDY) ; port ALERT
IN0: R158.1 R160.1 R162.1 U12.4(AIN0)
IN1: R157.1 R159.1 R161.1 U12.5(AIN1)
IN2: R152.1 R154.1 R156.1 U12.6(AIN2)
IN3: R151.1 R153.1 R155.1 U12.7(AIN3)
SCL: R148.1 U12.10(SCL) ; port SCL
SDA: R149.1 U12.9(SDA) ; port SDA
NetJP26_1: JP26.1 R153.2
NetJP27_1: JP27.1 R154.2
NetJP28_1: JP28.1 R159.2
NetJP29_1: JP29.1 R160.2

### Library data of the parts
C20 C21 = C: as C8#1 on sheet ESP32; 学习资源: www.ooocke.com
FB3 FB4 = FB: Ferrite Bead; BOM名称: 贴片电阻; 版权归属: 源创客; 学习资源: www.ooocke.com
JP26-JP29 = Header 2: 2P Connector; BOM名称: 2P接插件; 版权归属: 源创客; 学习资源: www.ooocke.com
R147-R162 = R: Chip resistor; 版权归属: 源创客; BOM名称: Chip resistor; 学习资源: www.ooocke.com
U12 = ADS1115: ADS111x Ultra-Small, Low-Power, I / 2C-Compatible, 860-SPS, 16-Bit ADCs / With Internal Reference, Oscillator, and Programmable Comparator; BOM名称: 数字电位器; 版权归属: 源创客; 学习资源: www.ooocke.com

## Sheet Analog Output.SchDoc
size A4; SheetNumber: 7; SheetTotal: 11
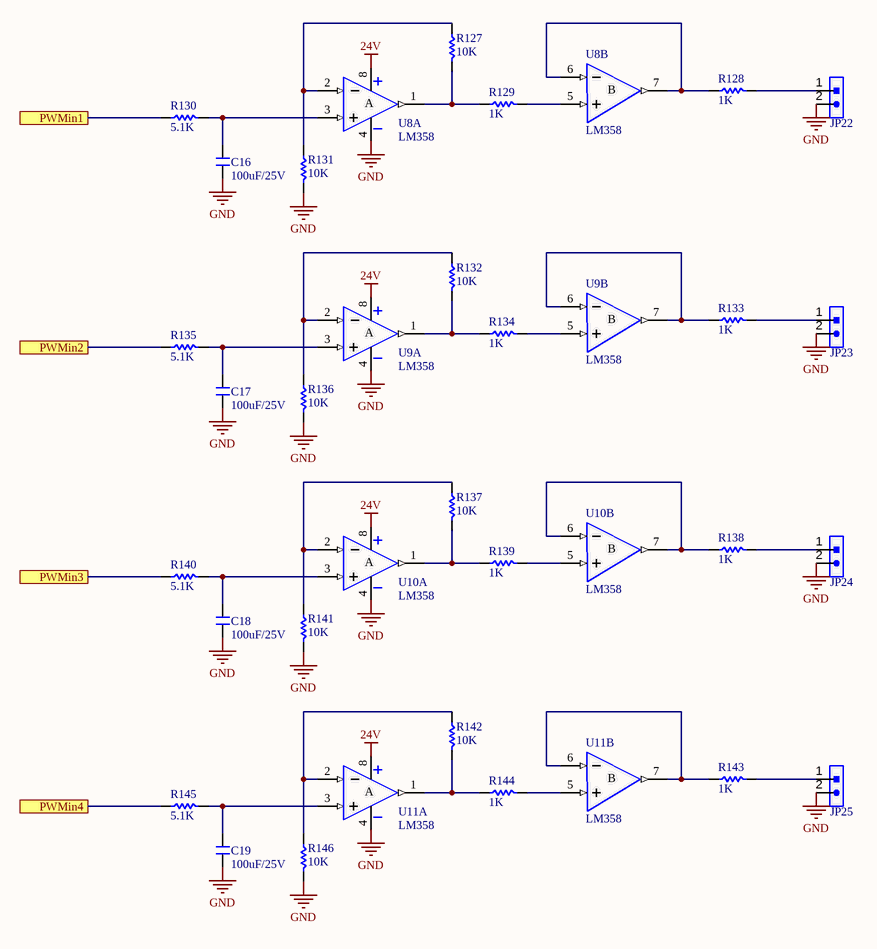
[diagram p7: Analog Output.SchDoc]

### Parts
C16  100uF/25V  [C 0805]
C17  100uF/25V  [C 0805]
C18  100uF/25V  [C 0805]
C19  100uF/25V  [C 0805]
JP22  HDR-1X2  [KF301-2P]  (value not drawn)
JP23  HDR-1X2  [KF301-2P]  (value not drawn)
JP24  HDR-1X2  [KF301-2P]  (value not drawn)
JP25  HDR-1X2  [KF301-2P]  (value not drawn)
R127  10K  [R 0805]
R128  1K  [R 0805]
R129  1K  [R 0805]
R130  5.1K  [R 0805]
R131  10K  [R 0805]
R132  10K  [R 0805]
R133  1K  [R 0805]
R134  1K  [R 0805]
R135  5.1K  [R 0805]
R136  10K  [R 0805]
R137  10K  [R 0805]
R138  1K  [R 0805]
R139  1K  [R 0805]
R140  5.1K  [R 0805]
R141  10K  [R 0805]
R142  10K  [R 0805]
R143  1K  [R 0805]
R144  1K  [R 0805]
R145  5.1K  [R 0805]
R146  10K  [R 0805]
U8  LM358  [SOP8_N]  (parts A,B of 2)
U9  LM358  [SOP8_N]  (parts A,B of 2)
U10  LM358  [SOP8_N]  (parts A,B of 2)
U11  LM358  [SOP8_N]  (parts A,B of 2)

### Ports
PWMin1, PWMin2, PWMin3, PWMin4

### Nets
24V: U8.8(VCC+) U9.8(VCC+) U10.8(VCC+) U11.8(VCC+)
GND: C16.2 C17.2 C18.2 C19.2 JP22.2 JP23.2 JP24.2 JP25.2 R131.2 R136.2 R141.2 R146.2 U8.4(VCC-) U9.4(VCC-) U10.4(VCC-) U11.4(VCC-)
PWMin1: R130.1 ; port PWMin1
PWMin2: R135.1 ; port PWMin2
PWMin3: R140.1 ; port PWMin3
PWMin4: R145.1 ; port PWMin4
NetC16_1: C16.1 R130.2 U8.3(IN1+)
NetC17_1: C17.1 R135.2 U9.3(IN1+)
NetC18_1: C18.1 R140.2 U10.3(IN1+)
NetC19_1: C19.1 R145.2 U11.3(IN1+)
NetJP22_1: JP22.1 R128.2
NetJP23_1: JP23.1 R133.2
NetJP24_1: JP24.1 R138.2
NetJP25_1: JP25.1 R143.2
NetR127_1: R127.1 R131.1 U8.2(IN1-)
NetR127_2: R127.2 R129.1 U8.1(OUT1)
NetR128_1: R128.1 U8.6(IN2-) U8.7(OUT2)
NetR129_2: R129.2 U8.5(IN2+)
NetR132_1: R132.1 R136.1 U9.2(IN1-)
NetR132_2: R132.2 R134.1 U9.1(OUT1)
NetR133_1: R133.1 U9.6(IN2-) U9.7(OUT2)
NetR134_2: R134.2 U9.5(IN2+)
NetR137_1: R137.1 R141.1 U10.2(IN1-)
NetR137_2: R137.2 R139.1 U10.1(OUT1)
NetR138_1: R138.1 U10.6(IN2-) U10.7(OUT2)
NetR139_2: R139.2 U10.5(IN2+)
NetR142_1: R142.1 R146.1 U11.2(IN1-)
NetR142_2: R142.2 R144.1 U11.1(OUT1)
NetR143_1: R143.1 U11.6(IN2-) U11.7(OUT2)
NetR144_2: R144.2 U11.5(IN2+)

### Notes on the sheet
- (in symbol LM358, part A) A
- (in symbol LM358, part B) B

### Library data of the parts
C16-C19 = C: as C8#1 on sheet ESP32; 学习资源: www.ooocke.com
JP22-JP25 = Header 2: 2P Connector; BOM名称: 2P接插件; 版权归属: 源创客; 学习资源: www.ooocke.com
R127-R146 = R: Chip resistor; 版权归属: 源创客; BOM名称: Chip resistor; 学习资源: www.ooocke.com
U8-U11 = LM358: Dual op amp; BOM名称: 双路运放; 版权归属: 源创客; 学习资源: www.ooocke.com

## Nets that join several sheets
24V: Power Regulator (6 pins), Digital Output (32 pins), Analog Output (U8.8 U9.8 U10.8 U11.8)
GND: Power Regulator (7 pins), Digital Output (24 pins), Analog Input (JP26.2 JP27.2 JP28.2 JP29.2), Analog Output (16 pins)
GND_F: Main (8 pins), ESP32 (8 pins), RS485 (6 pins), Power Regulator (17 pins), Digital Output (14 pins), LAN (13 pins), Analog Input (FB4.1)
LM_Out+: Main (9 pins), ESP32 (6 pins), RS485 (11 pins), Power Regulator (8 pins), Digital Output (15 pins), LAN (10 pins), Analog Input (FB3.1)
485_DE: ESP32 (U6.30), RS485 (6 pins)
485_DI: ESP32 (U6.28), RS485 (R98.1 R102.2 R104.1 U5.4)
485_RO: ESP32 (U6.27), RS485 (R95.1 U5.1)
mcpINT: Main (U1.8), ESP32 (U6.8)
OutputINT: ESP32 (U6.6), Digital Output (U4.8)
PWMin1: ESP32 (U6.9), Analog Output (R130.1)
PWMin2: ESP32 (U6.10), Analog Output (R135.1)
PWMin3: ESP32 (U6.11), Analog Output (R140.1)
PWMin4: ESP32 (U6.12), Analog Output (R145.1)
SCL: Main (JP1#1.2 U1.1), ESP32 (U6.36), Digital Output (C5.2 R67.2 U4.1), Analog Input (R148.1 U12.10)
SDA: Main (JP1#1.1 U1.2), ESP32 (U6.33), Digital Output (C4.2 R66.2 U4.2), Analog Input (R149.1 U12.9)